# Altium schematic sheet TOP.SchDoc
size A3
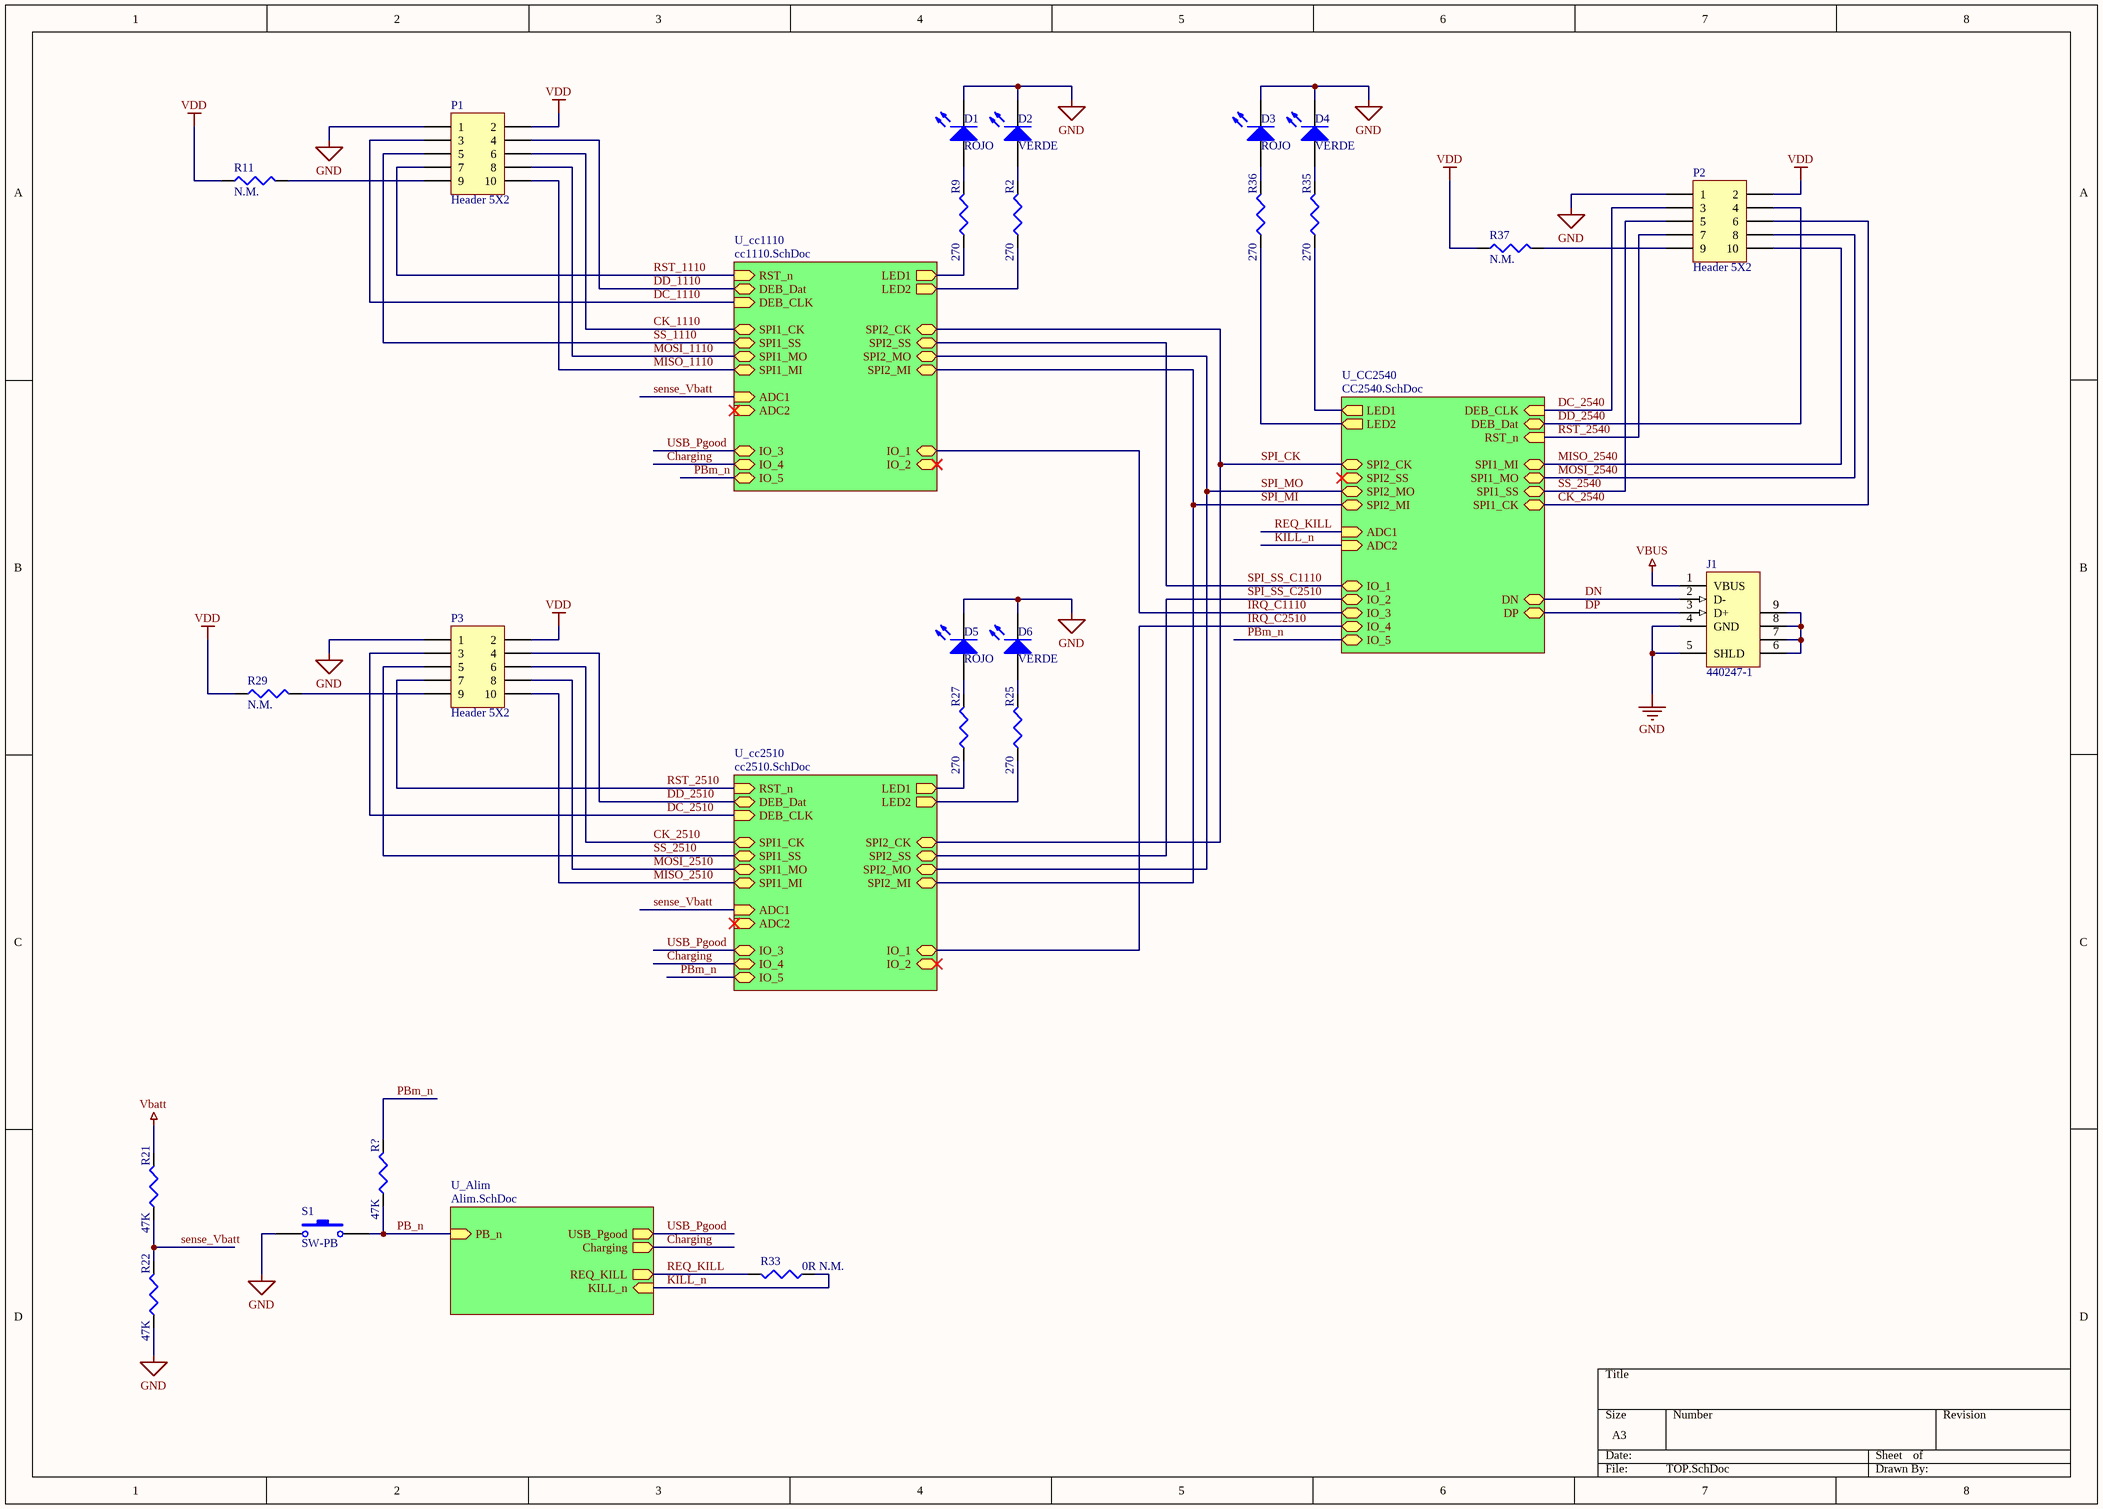
[diagram p0: TOP.SchDoc]

## Parts
D1  ROJO  [led_0805]
D2  VERDE  [led_0805]
D3  ROJO  [led_0805]
D4  VERDE  [led_0805]
D5  ROJO  [led_0805]
D6  VERDE  [led_0805]
J1  440247-1  [USB_C10418]
P1  Header 5X2  [stl21]
P2  Header 5X2  [stl21]
P3  Header 5X2  [stl21]
R2  value 270  [J1-0603]  (hidden comment: Res3)
R9  value 270  [J1-0603]  (hidden comment: Res3)
R11  value N.M.  [J1-0603]  (hidden comment: Res3)
R21  value 47K  [J1-0603]  (hidden comment: Res3)
R22  value 47K  [J1-0603]  (hidden comment: Res3)
R25  value 270  [J1-0603]  (hidden comment: Res3)
R27  value 270  [J1-0603]  (hidden comment: Res3)
R29  value N.M.  [J1-0603]  (hidden comment: Res3)
R33  value 0R N.M.  [J1-0603]  (hidden comment: Res3)
R35  value 270  [J1-0603]  (hidden comment: Res3)
R36  value 270  [J1-0603]  (hidden comment: Res3)
R37  value N.M.  [J1-0603]  (hidden comment: Res3)
R?  value 47K  [J1-0603]  (hidden comment: Res3)
S1  SW-PB  [puls_C3682]

## Sub-sheets
U_Alim = Alim.SchDoc: USB_Pgood (out), Charging (out), KILL_n (in), PB_n (in), REQ_KILL (out)
U_cc1110 = cc1110.SchDoc: DEB_Dat (bidir), DEB_CLK (in), RST_n (in), SPI1_MI (bidir), SPI1_MO (bidir), SPI1_SS (bidir), SPI1_CK (bidir), SPI2_CK (bidir), SPI2_SS (bidir), SPI2_MO (bidir), SPI2_MI (bidir), LED1 (out), LED2 (out), ADC1 (in), ADC2 (in), IO_1 (bidir), IO_2 (bidir), IO_3 (bidir), IO_4 (bidir), IO_5 (bidir)
U_cc2510 = cc2510.SchDoc: DEB_Dat (bidir), DEB_CLK (in), RST_n (in), SPI1_MI (bidir), SPI1_MO (bidir), SPI1_SS (bidir), SPI1_CK (bidir), SPI2_CK (bidir), SPI2_SS (bidir), SPI2_MO (bidir), SPI2_MI (bidir), LED1 (out), LED2 (out), ADC1 (in), ADC2 (in), IO_1 (bidir), IO_2 (bidir), IO_3 (bidir), IO_4 (bidir), IO_5 (bidir)
U_CC2540 = CC2540.SchDoc: DEB_Dat (bidir), DEB_CLK (in), RST_n (in), SPI1_MI (bidir), SPI1_MO (bidir), SPI1_SS (bidir), SPI1_CK (bidir), SPI2_CK (bidir), SPI2_SS (bidir), SPI2_MO (bidir), SPI2_MI (bidir), LED1 (out), LED2 (out), ADC1 (in), ADC2 (in), IO_1 (bidir), IO_2 (bidir), IO_3 (bidir), IO_4 (bidir), IO_5 (bidir), DP (bidir), DN (bidir)

## Nets
GND: D1.2(K) D2.2(K) D3.2(K) D4.2(K) D5.2(K) D6.2(K) J1.4(GND) J1.5(SHLD) P1.1 P2.1 P3.1 R22.1 S1.1
Vbatt: R21.2
VBUS: J1.1(VBUS)
VDD: P1.2 P2.2 P3.2 R11.1 R29.1 R37.1
Charging: sheet U_cc1110/IO_4, sheet U_cc2510/IO_4, sheet U_Alim/Charging
CK_1110: P1.6 ; sheet U_cc1110/SPI1_CK
CK_2510: P3.6 ; sheet U_cc2510/SPI1_CK
CK_2540: P2.6 ; sheet U_CC2540/SPI1_CK
DC_1110: P1.3 ; sheet U_cc1110/DEB_CLK
DC_2510: P3.3 ; sheet U_cc2510/DEB_CLK
DC_2540: P2.3 ; sheet U_CC2540/DEB_CLK
DD_1110: P1.4 ; sheet U_cc1110/DEB_Dat
DD_2510: P3.4 ; sheet U_cc2510/DEB_Dat
DD_2540: P2.4 ; sheet U_CC2540/DEB_Dat
DN: J1.2(D-) ; sheet U_CC2540/DN
DP: J1.3(D+) ; sheet U_CC2540/DP
IRQ_C1110: sheet U_cc1110/IO_1, sheet U_CC2540/IO_3
IRQ_C2510: sheet U_cc2510/IO_1, sheet U_CC2540/IO_4
KILL_n: R33.1 ; sheet U_CC2540/ADC2, sheet U_Alim/KILL_n
MISO_1110: P1.10 ; sheet U_cc1110/SPI1_MI
MISO_2510: P3.10 ; sheet U_cc2510/SPI1_MI
MISO_2540: P2.10 ; sheet U_CC2540/SPI1_MI
MOSI_1110: P1.8 ; sheet U_cc1110/SPI1_MO
MOSI_2510: P3.8 ; sheet U_cc2510/SPI1_MO
MOSI_2540: P2.8 ; sheet U_CC2540/SPI1_MO
PB_n: R?.1 S1.2 ; sheet U_Alim/PB_n
PBm_n: R?.2 ; sheet U_cc1110/IO_5, sheet U_cc2510/IO_5, sheet U_CC2540/IO_5
REQ_KILL: R33.2 ; sheet U_CC2540/ADC1, sheet U_Alim/REQ_KILL
RST_1110: P1.7 ; sheet U_cc1110/RST_n
RST_2510: P3.7 ; sheet U_cc2510/RST_n
RST_2540: P2.7 ; sheet U_CC2540/RST_n
sense_Vbatt: R21.1 R22.2 ; sheet U_cc1110/ADC1, sheet U_cc2510/ADC1
SPI_CK: sheet U_cc1110/SPI2_CK, sheet U_cc2510/SPI2_CK, sheet U_CC2540/SPI2_CK
SPI_MI: sheet U_cc1110/SPI2_MI, sheet U_cc2510/SPI2_MI, sheet U_CC2540/SPI2_MI
SPI_MO: sheet U_cc1110/SPI2_MO, sheet U_cc2510/SPI2_MO, sheet U_CC2540/SPI2_MO
SPI_SS_C1110: sheet U_cc1110/SPI2_SS, sheet U_CC2540/IO_1
SPI_SS_C2510: sheet U_cc2510/SPI2_SS, sheet U_CC2540/IO_2
SS_1110: P1.5 ; sheet U_cc1110/SPI1_SS
SS_2510: P3.5 ; sheet U_cc2510/SPI1_SS
SS_2540: P2.5 ; sheet U_CC2540/SPI1_SS
USB_Pgood: sheet U_cc1110/IO_3, sheet U_cc2510/IO_3, sheet U_Alim/USB_Pgood
NetD1_1: D1.1(A) R9.2
NetD2_1: D2.1(A) R2.2
NetD3_1: D3.1(A) R36.2
NetD4_1: D4.1(A) R35.2
NetD5_1: D5.1(A) R27.2
NetD6_1: D6.1(A) R25.2
NetJ1_6: J1.6(SHLD) J1.7(SHLD) J1.8(SHLD) J1.9(SHLD)
NetP1_9: P1.9 R11.2
NetP2_9: P2.9 R37.2
NetP3_9: P3.9 R29.2
NetR2_1: R2.1 ; sheet U_cc1110/LED2
NetR9_1: R9.1 ; sheet U_cc1110/LED1
NetR25_1: R25.1 ; sheet U_cc2510/LED2
NetR27_1: R27.1 ; sheet U_cc2510/LED1
NetR35_1: R35.1 ; sheet U_CC2540/LED1
NetR36_1: R36.1 ; sheet U_CC2540/LED2

## Library data of the parts
D1 D3 D5 = LED2: Typical RED, GREEN, YELLOW, AMBER GaAs LED; Manufacturer: Smart Prototyping; SP: SP-C2286; FARNELL: 2099236; Value: Rojo; Order N: SP-C2286
D2 D4 D6 = LED2: Typical RED, GREEN, YELLOW, AMBER GaAs LED; Manufacturer: Smart Prototyping; SP: SP-C2292; FARNELL: 2290331; Value: Verde; Order N: SP-C2292
J1 = 440247-1: USB 2.0, Right Angle, SMT, B Type, Receptacle, 5 Position, Black; Manufacturer: Smart Prototyping; SP: SP-C10418; Published: 15-Jul-2004; PackageReference: 440247; Publisher: Altium Limited; Order N: SP-C10418
P1-P3 = Header 5X2: Header, 5-Pin, Dual row; Manufacturer: Smart Prototyping; SP: SP-C12650; LatestRevisionDate: 17-Jul-2002; LatestRevisionNote: Re-released for DXP Platform.; Publisher: Altium Limited; Order N: SP-C12650
R2 R9 R25 R27 R35 R36 = Res3: Resistor; Manufacturer: FARNELL; RS: 721-7292; Order N: 2331719; Published: 8-Jun-2000; LatestRevisionDate: 29-May-2009; LatestRevisionNote: IPC-7351 Footprint Added.; PackageReference: J1-0603; Publisher: Altium Limited; PackageDescription: Chip Resistor; FARNELL: 2331719
R11 R29 R37 = Res3: Resistor; Published: 8-Jun-2000; LatestRevisionDate: 29-May-2009; LatestRevisionNote: IPC-7351 Footprint Added.; PackageReference: J1-0603; Publisher: Altium Limited; PackageDescription: Chip Resistor
R21 R22 R? = Res3: Resistor; Manufacturer: FARNELL; RS: N.E.; Order N: 2331749; Published: 8-Jun-2000; LatestRevisionDate: 29-May-2009; LatestRevisionNote: IPC-7351 Footprint Added.; PackageReference: J1-0603; Publisher: Altium Limited; PackageDescription: Chip Resistor; FARNELL: 2331749
R33 = Res3: Resistor; RS: 740-8870; Published: 8-Jun-2000; LatestRevisionDate: 29-May-2009; LatestRevisionNote: IPC-7351 Footprint Added.; PackageReference: J1-0603; Publisher: Altium Limited; PackageDescription: Chip Resistor; FARNELL: 2309106
S1 = SW-PB: Switch; Manufacturer: Smart Prototyping; SP: SP-C3682; Published: 24-Mar-1999; LatestRevisionDate: 17-Jul-2002; LatestRevisionNote: Re-released for DXP Platform.; PackageReference: SPST-2; Publisher: Altium Limited; PackageDescription: Switch; 2 Leads; Order N: SP-C3682